# Altium schematic sheet PATHOS_FPGA_Power.SchDoc: FPGA Power
size A4; Author: A. Kalberer; CompanyName: NTB; Organization: NTB Interstate University of Applied; Address1: Werdenbergstrasse 4; Address3: 9471 Buchs; Address4: Switzerland; Organization1: Sciences of Technology Buchs; Size: A4
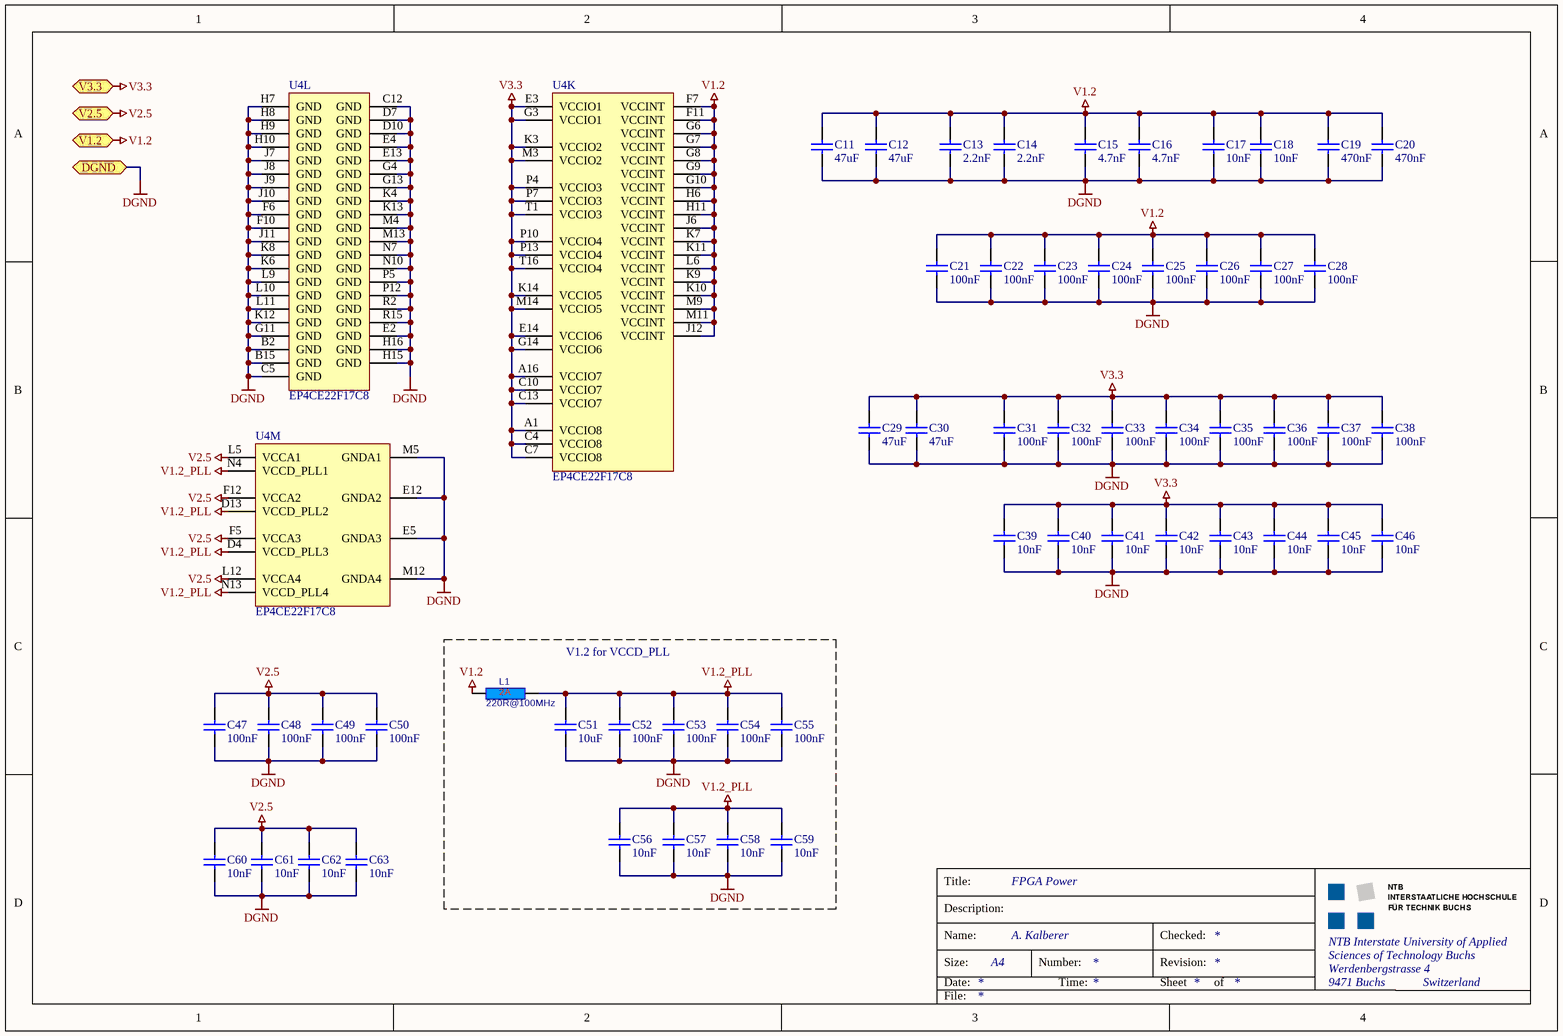
[diagram p0: PATHOS_FPGA_Power.SchDoc]

## Parts
C11  47uF  [0805_3D]
C12  47uF  [0805_3D]
C13  2.2nF  [0402_3D]
C14  2.2nF  [0402_3D]
C15  4.7nF  [0402_3D]
C16  4.7nF  [0402_3D]
C17  10nF  [0402_3D]
C18  10nF  [0402_3D]
C19  470nF  [0603_3D]
C20  470nF  [0603_3D]
C21  100nF  [0402_3D]
C22  100nF  [0402_3D]
C23  100nF  [0402_3D]
C24  100nF  [0402_3D]
C25  100nF  [0402_3D]
C26  100nF  [0402_3D]
C27  100nF  [0402_3D]
C28  100nF  [0402_3D]
C29  47uF  [0805_3D]
C30  47uF  [0805_3D]
C31  100nF  [0402_3D]
C32  100nF  [0402_3D]
C33  100nF  [0402_3D]
C34  100nF  [0402_3D]
C35  100nF  [0402_3D]
C36  100nF  [0402_3D]
C37  100nF  [0402_3D]
C38  100nF  [0402_3D]
C39  10nF  [0402_3D]
C40  10nF  [0402_3D]
C41  10nF  [0402_3D]
C42  10nF  [0402_3D]
C43  10nF  [0402_3D]
C44  10nF  [0402_3D]
C45  10nF  [0402_3D]
C46  10nF  [0402_3D]
C47  100nF  [0402_3D]
C48  100nF  [0402_3D]
C49  100nF  [0402_3D]
C50  100nF  [0402_3D]
C51  10uF  [0603_3D]
C52  100nF  [0402_3D]
C53  100nF  [0402_3D]
C54  100nF  [0402_3D]
C55  100nF  [0402_3D]
C56  10nF  [0402_3D]
C57  10nF  [0402_3D]
C58  10nF  [0402_3D]
C59  10nF  [0402_3D]
C60  10nF  [0402_3D]
C61  10nF  [0402_3D]
C62  10nF  [0402_3D]
C63  10nF  [0402_3D]
L1  220R@100MHz  [0603_3D]
U4  EP4CE22F17C8  [FBGA256]  (parts K,L,M of 13)

## Blocks framed on the sheet
V1.2 for VCCD_PLL: C51-C59 L1

## Ports
DGND, V1.2, V2.5, V3.3

## Nets
DGND: C11.1 C12.1 C13.1 C14.1 C15.1 C16.1 C17.1 C18.1 C19.1 C20.1 C21.1 C22.1 C23.1 C24.1 C25.1 C26.1 C27.1 C28.1 C29.1 C30.1 C31.1 C32.1 C33.1 C34.1 C35.1 C36.1 C37.1 C38.1 C39.1 C40.1 C41.1 C42.1 C43.1 C44.1 C45.1 C46.1 C47.1 C48.1 C49.1 C50.1 C51.1 C52.1 C53.1 C54.1 C55.1 C56.1 C57.1 C58.1 C59.1 C60.1 C61.1 C62.1 C63.1 U4.B2(GND) U4.B15(GND) U4.C5(GND) U4.C12(GND) U4.D7(GND) U4.D10(GND) U4.E2(GND) U4.E4(GND) U4.E5(GNDA3) U4.E12(GNDA2) U4.E13(GND) U4.F6(GND) U4.F10(GND) U4.G4(GND) U4.G11(GND) U4.G13(GND) U4.H7(GND) U4.H8(GND) U4.H9(GND) U4.H10(GND) U4.H15(GND) U4.H16(GND) U4.J7(GND) U4.J8(GND) U4.J9(GND) U4.J10(GND) U4.J11(GND) U4.K4(GND) U4.K6(GND) U4.K8(GND) U4.K12(GND) U4.K13(GND) U4.L9(GND) U4.L10(GND) U4.L11(GND) U4.M4(GND) U4.M5(GNDA1) U4.M12(GNDA4) U4.M13(GND) U4.N7(GND) U4.N10(GND) U4.P5(GND) U4.P12(GND) U4.R2(GND) U4.R15(GND) ; port DGND
V1.2: C11.2 C12.2 C13.2 C14.2 C15.2 C16.2 C17.2 C18.2 C19.2 C20.2 C21.2 C22.2 C23.2 C24.2 C25.2 C26.2 C27.2 C28.2 L1.1 U4.F7(VCCINT) U4.F11(VCCINT) U4.G6(VCCINT) U4.G7(VCCINT) U4.G8(VCCINT) U4.G9(VCCINT) U4.G10(VCCINT) U4.H6(VCCINT) U4.H11(VCCINT) U4.J6(VCCINT) U4.J12(VCCINT) U4.K7(VCCINT) U4.K9(VCCINT) U4.K10(VCCINT) U4.K11(VCCINT) U4.L6(VCCINT) U4.M9(VCCINT) U4.M11(VCCINT) ; port V1.2
V1.2_PLL: C51.2 C52.2 C53.2 C54.2 C55.2 C56.2 C57.2 C58.2 C59.2 L1.2 U4.D4(VCCD_PLL3) U4.D13(VCCD_PLL2) U4.N4(VCCD_PLL1) U4.N13(VCCD_PLL4)
V2.5: C47.2 C48.2 C49.2 C50.2 C60.2 C61.2 C62.2 C63.2 U4.F5(VCCA3) U4.F12(VCCA2) U4.L5(VCCA1) U4.L12(VCCA4) ; port V2.5
V3.3: C29.2 C30.2 C31.2 C32.2 C33.2 C34.2 C35.2 C36.2 C37.2 C38.2 C39.2 C40.2 C41.2 C42.2 C43.2 C44.2 C45.2 C46.2 U4.A1(VCCIO8) U4.A16(VCCIO7) U4.C4(VCCIO8) U4.C7(VCCIO8) U4.C10(VCCIO7) U4.C13(VCCIO7) U4.E3(VCCIO1) U4.E14(VCCIO6) U4.G3(VCCIO1) U4.G14(VCCIO6) U4.K3(VCCIO2) U4.K14(VCCIO5) U4.M3(VCCIO2) U4.M14(VCCIO5) U4.P4(VCCIO3) U4.P7(VCCIO3) U4.P10(VCCIO4) U4.P13(VCCIO4) U4.T1(VCCIO3) U4.T16(VCCIO4) ; port V3.3

## Notes on the sheet
- Title:
- Description:
- Size:
- Date:
- Name:
- Number:
- Time:
- Revision:
- Sheet
- Checked:
- of
- File:

## Library data of the parts
C11 C12 C29 C30 = C: Capacitor; #Manufacturer: Generic Components; #Publisher: Dr. A. Heinzelmann; #Class: Passive; Initial Voltage: 0V; Type: Ceramic; #Published: 2006-10-07; #ClassSub: Capacitor; Voltage Maximum: *; Value: 47uF
C13-C28 C31-C63 = C: Capacitor; #Manufacturer: Generic Components; #Publisher: Dr. A. Heinzelmann; #Class: Passive; Initial Voltage: 0V; #Published: 2006-10-07; #ClassSub: Capacitor; Type: *; Voltage Maximum: *
  C13 C14: Value: 2.2nF
  C15 C16: Value: 4.7nF
  C17 C18 C39-C46 C56-C63: Value: 10nF
  C19 C20: Value: 470nF
  C21-C28 C31-C38 C47-C50 C52-C55: Value: 100nF
  C51: Value: 10uF
L1 = L-220R@100MHz-2A-25%-0603: 220R@100MHz 2A EMI FILTER; Tolerance: 25%; Rating: 2A; Value: 220R@100MHz
U4 = EP4CE22F17C8: Cyclone IV Family FPGA, 2V Core, 153 I/O Pins, 4 PLLs, 256-Pin FBGA, Speed Grade 8, Commercial Grade; Published: 3-May-2010; DatasheetVersion: ver1.2, Mar-2010; PackageVersion: ver16.0, Dec-2009; PackageReference: FBGA256; Publisher: Altium Limited; PackageDescription: 256-Ball FineLine Ball Grid Array (FBGA256) - Option 1 - Wire Bond; Supplier 1: Digi-Key; Supplier Part Number 1: EP4CE22F17C8-ND; Code_JEDEC: MS-034-AAF-1; Code_IPC: BGA100P16X16-256; ComponentLink1Description: Manufacturer Link; ComponentLink1URL: http://www.altera.com/; ComponentLink2Description: Handbook; ComponentLink2URL: http://www.altera.com/literature/hb/cyclone-iv/cyclone4-handbook.pdf; ComponentLink3Description: Pinout Specification; ComponentLink3URL: http://www.altera.com/literature/lit-dp.jsp?category=cyc%204&showspreadsheet=y; ComponentLink4Description: Packaging Specification; ComponentLink4URL: http://www.altera.com/literature/ds/dspkg.pdf